# Altium schematic sheet STM32WL_ADC.SchDoc
size A4; SheetNumber: 5; SheetTotal: 5; SPICEModelCacheMWGQCNEB: <root> / <DocumentId>MWGQCNEB</DocumentId> / <CacheFrame Number="0"> / <Model Name="mcp6001" Kind="CKT"> / <Text>.SUBCKT MCP6001 1 2 3 4 5 / *               | | | | | / *               | | | | Output / *               | | | Negative Supply / *               | | Positive Supply / *               | Inverting Input / *               Non-inverting Input / * / ******************************************************************************** / * Software License Agreement                                                   * / *                                                                              * / * The software supplied herewith by Microchip Technology Incorporated (the     * / * "Company") is intended and supplied to you, the Company's customer, for use  * / * soley and exclusively on Microchip products.                                 * / *                                                                              * / * The software is owned by the Company and/or its supplier, and is protected   * / * under applicable copyright laws. All rights are reserved. Any use in         * / * violation of the foregoing restrictions may subject the user to criminal     * / * sanctions under applicable laws, as well as to civil liability for the       * / * breach of the terms and conditions of this license.                          * / *                                                                              * / * THIS SOFTWARE IS PROVIDED IN AN "AS IS" CONDITION. NO WARRANTIES, WHETHER    * / * EXPRESS, IMPLIED OR STATUTORY, INCLUDING, BUT NOT LIMITED TO, IMPLIED        * / * WARRANTIES OF MERCHANTABILITY AND FITNESS FOR A PARTICULAR PURPOSE APPLY TO  * / * THIS SOFTWARE. THE COMPANY SHALL NOT, IN ANY CIRCUMSTANCES, BE LIABLE FOR    * / * SPECIAL, INCIDENTAL OR CONSEQUENTIAL DAMAGES, FOR ANY REASON WHATSOEVER.     * / ******************************************************************************** / * / * Macromodel for the MCP6001/2/4 op amp family: / *   MCP6001, MCP6001R, MCP6001U, MCP6002, MCP6004 / * / * Revision History: / *   REV A: 21-Jun-02, Created model / *   REV B: 16-Jul-02, Improved output stage / *   REV C: 03-Jan-03, Added MCP6001 / *   REV D: 19-Aug-06, Added over temperature, improved output stage, / *                     fixed overdrive recovery time / *   REV E: 27-Jul-07, Updated output impedance for better model stability w/cap load / *   REV F: 09-Jul-12, Added MCP6001R, MCP6001U / * / * Recommendations: / *   Use PSPICE (other simulators may require translation) / *   For a quick, effective design, use a combination of: data sheet / *     specs, bench testing, and simulations with this macromodel / *   For high impedance circuits, set GMIN=100F in .OPTIONS / * / * Supported: / *   Typical performance for temperature range (-40 to 125) degrees Celsius / *   DC, AC, Transient, and Noise analyses. / *   Most specs, including: offsets, DC PSRR, DC CMRR, input impedance, / *     open loop gain, voltage ranges, supply current, ... , etc. / *   Temperature effects for Ibias, Iquiescent, Iout short circuit / *   current, Vsat on both rails, Slew Rate vs. Temp and P.S. / * / * Not Supported: / *   Some Variation in specs vs. Power Supply Voltage / *   Monte Carlo (Vos, Ib), Process variation / *   Distortion (detailed non-linear behavior) / *   Behavior outside normal operating region / * / * Input Stage / V10  3 10 -500M / R10 10 11 6.90K / R11 10 12 6.90K / C11 11 12 0.2p / C12 1  0 6.00P / E12 71 14 POLY(4) 20 0 21 0 26 0 27 0   1.00M 20.1 20.1 1 1 / G12 1 0 62 0 1m / M12 11 14 15 15 NMI L=2.00U W=42.0U / M14 12  2 15 15 NMI L=2.00U W=42.0U / G14 2 0 62 0 1m / C14  2  0 6.00P / I15 15  4 50.0U / V16 16  4 -300M / GD16 16 1 TABLE {V(16,1)} ((-100,-1p)(0,0)(1m,1n)(2m,1m)(3m,1)) / V13  3 13 -300M / GD13 2 13 TABLE {V(2,13)} ((-100,-1p)(0,0)(1m,1n)(2m,1m)(3m,1)) / R70 1 0 20.6T / R71 2 0 20.6T / R72 1 2 20T / I80 1 2 0.5p / * / * Noise, PSRR, and CMRR / I20 21 20 423U / D20 20  0 DN1 / D21  0 21 DN1 / G26  0 26 POLY(1) 3 4   110U -49U / R26 26  0 1 / G27  0 27 POLY(2) 1 0 2 0   -440U 39.7U 39.7U / R27 27  0 1 / * / * Open Loop Gain, Slew Rate / G30  0 30 POLY(1) 12 11   0 1 / R30 30  0 1K / G31  0 31 POLY(1) 3 4 86 5.25 / R31 31  0 1 TC=2.8m / GD31 30 31 TABLE {V(30,31)} ((-11,-1)(-10,-10n)(0,0)(1m,1000)) / G32 32  0 POLY(1) 3 4 113.7 3.5 / R32 32  0 1 TC=2.65m / GD32 30 32 TABLE {V(30,32)} ((-1m,-1000)(0,0)(10,10n)(11,1)) / G33 0 33 30 0 1m / R33 33 0 1k / G34  0 34 33 0 425M / R34  34 0 1K / C34  34 0 74U / G37  0 37 34 0 1m / R37  37 0 1K / C37  37 0 41.6P / G38  0 38 37 0 1m / R38  39 0 1K / L38  38 39 100U / E38  35 0 38 0 1 / G35 33 0 TABLE {V(35,3)} ((-1,-1n)(0,0)(16,1n))(16.1,1)) / G36 33 0 TABLE {V(35,4)} ((-16.1,-1)((-16,-1n)(0,0)(1,1n)) / * / * Output Stage / R80 50 0 100MEG / G50 0 50 57 96 2 / R58 57  96 0.50 / R57 57  0 750 / C58  5  0 2.00P / G57  0 57 POLY(3) 3 0 4 0 35 0   0 0.67M 0.67M 1.5M / GD55 55 57 TABLE {V(55,57)} ((-2m,-1)(-1m,-1m)(0,0)(10,1n)) / GD56 57 56 TABLE {V(57,56)} ((-2m,-1)(-1m,-1m)(0,0)(10,1n)) / E55 55  0 POLY(2) 3 0 51 0 -0.7m 1 -40.0M / E56 56  0 POLY(2) 4 0 52 0 1.2m 1 -37.0M / R51 51 0 1k / R52 52 0 1k / GD51 50 51 TABLE {V(50,51)} ((-10,-1n)(0,0)(1m,1m)(2m,1)) / GD52 50 52 TABLE {V(50,52)} ((-2m,-1)(-1m,-1m)(0,0)(10,1n)) / G53  3  0 POLY(1) 51 0  -49U 1M / G54  0  4 POLY(1) 52 0  -49U -1M / * / * Current Limit / G99 96 5 99 0 1 / R98 0 98 1 TC=-2.8M,2.63U / G97 0 98 TABLE { V(96,5) } ((-11.0,-10.0M)(-1.00M,-9.9M)(0,0)(1.00M,9.9M)(11.0,10.0M)) / E97 99 0 VALUE { V(98)*((V(3)-V(4))*359M + 310M)} / D98 4 5 DESD / D99 5 3 DESD / * / * Temperature / Voltage Sensitive IQuiscent / R61 0 61 100 TC 3.11M 4.51U / G61 3 4 61 0 1 / G60 0 61 TABLE {V(3, 4)} / + ((0,0)(900M,0.0106U)(1.00,0.20U)(1.3,0.63U) / + (1.5,0.66U)(1.6,1.06U)(5.5,1.10U)) / * / * Temp Sensitive offset voltage / I73 0 70 DC 1uA / R74 0 70 1 TC=2 / E75 1 71 70 0 1 / * / * Temp Sensistive IBias / I62 0 62 DC 1uA / R62 0 62 REXP 58.2u / * Voltage on R62 used for G12, G14 in input stage / * / * Models / .MODEL NMI NMOS / .MODEL DESD  D   N=1 IS=1.00E-15 / .MODEL DL  D   N=1 IS=1F / .MODEL DN1 D   IS=1P KF=146E-18 AF=1 / .MODEL REXP RES TCE=10.1 / .ENDS MCP6001</Text> / </Model> / </CacheFrame> / </root>
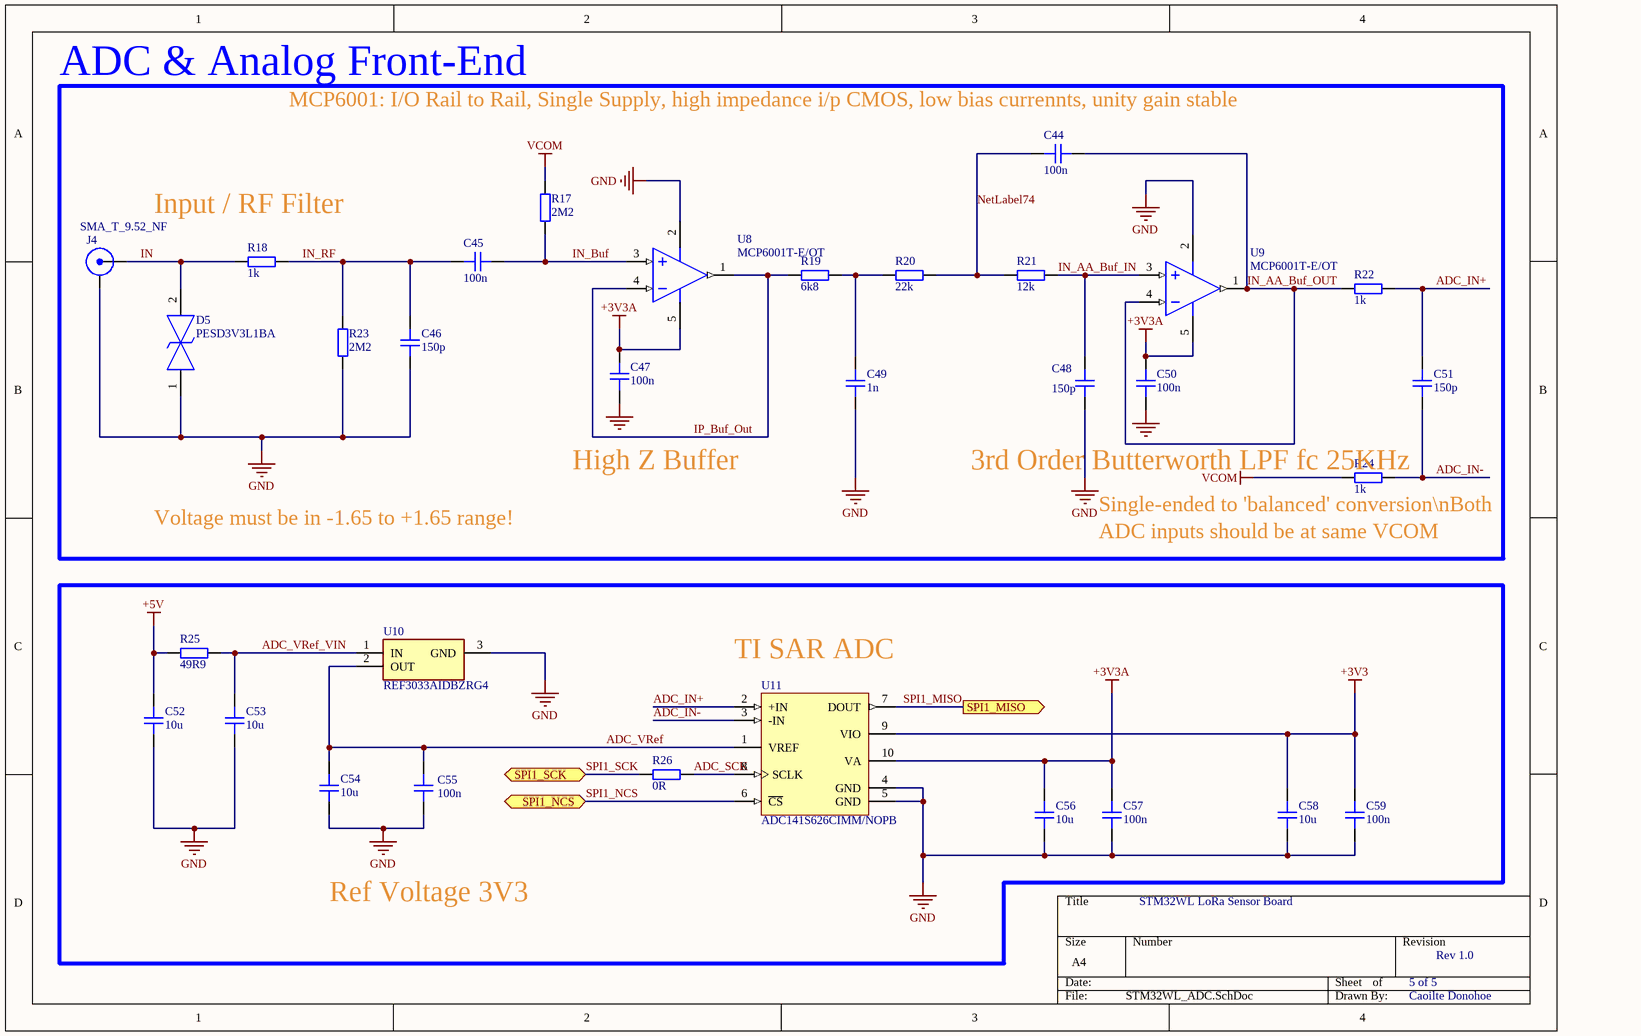
[diagram p0: STM32WL_ADC.SchDoc]

## Parts
C44  100n  [CAP_0402]
C45  100n  [CAP_0402]
C46  150p  [CAP_0402]
C47  100n  [CAP_0402]
C48  150p  [CAP_0402]
C49  1n  [CAP_0402]
C50  100n  [CAP_0402]
C51  150p  [CAP_0402]
C52  10u  [CAP_0603]
C53  10u  [CAP_0603]
C54  10u  [CAP_0603]
C55  100n  [CAP_0402]
C56  10u  [CAP_0603]
C57  100n  [CAP_0402]
C58  10u  [CAP_0603]
C59  100n  [CAP_0402]
D5  PESD3V3L1BA  [SOD2512X110N]
J4  SMA_T_9.52_NF  [CO_SAMTEC_SMA-J-P-ST-EMI]
R17  2M2  [RES_0402]
R18  1k  [RES_0402]
R19  6k8  [RES_0402]
R20  22k  [RES_0402]
R21  12k  [RES_0402]
R22  1k  [RES_0402]
R23  2M2  [RES_0402]
R24  1k  [RES_0402]
R25  49R9  [RES_0402]
R26  0R  [RES_0402]
U8  MCP6001T-E/OT  [SOT-23-OT5_L]
U9  MCP6001T-E/OT  [SOT-23-OT5_L]
U10  REF3033AIDBZRG4  [SOT95P237X112-3N]
U11  ADC141S626CIMM/NOPB  [MUB10A_M]

## Blocks framed on the sheet
ADC & Analog Front-End: C44-C51 D5 J4 R17-R24 U8 U9

## Ports
SPI1_MISO (out, see STM32WL_MCU_IOs[2B]), SPI1_NCS (bidir, see STM32WL_MCU_IOs[2B]), SPI1_SCK (bidir, see STM32WL_MCU_IOs[1B])

## Nets
+3V3: C58.2 C59.2 U11.9(VIO)
+3V3A: C47.1 C50.1 C56.2 C57.2 U8.5(VDD) U9.5(VDD) U11.10(VA)
+5V: C52.2 R25.1
GND: C46.1 C47.2 C48.1 C49.1 C50.2 C52.1 C53.1 C54.1 C55.1 C56.1 C57.1 C58.1 C59.1 D5.1 J4.2(Y) R23.1 U8.2(VSS) U9.2(VSS) U10.3(GND) U11.4(GND) U11.5(GND)
VCOM: R17.2 R24.2
ADC_IN+: C51.1 R22.1 U11.2(+IN)
ADC_IN-: C51.2 R24.1 U11.3(-IN)
ADC_SCK: R26.2 U11.8(SCLK)
ADC_VRef: C54.2 C55.2 U10.2(OUT) U11.1(VREF)
ADC_VRef_VIN: C53.2 R25.2 U10.1(IN)
IN: D5.2 J4.1(X) R18.1
IN_AA_Buf_IN: C48.2 R21.1 U9.3(VIN+)
IN_AA_Buf_OUT: C44.1 R22.2 U9.1(VOUT) U9.4(VIN-)
IN_Buf: C45.1 R17.1 U8.3(VIN+)
IN_RF: C45.2 C46.2 R18.2 R23.2
IP_Buf_Out: R19.2 U8.1(VOUT) U8.4(VIN-)
NetLabel74: C44.2 R20.1 R21.2
SPI1_MISO: U11.7(DOUT) ; port SPI1_MISO
SPI1_NCS: U11.6(~{CS}) ; port SPI1_NCS
SPI1_SCK: R26.1 ; port SPI1_SCK
NetC49_2: C49.2 R19.1 R20.2

## Notes on the sheet
- (near C44) MCP6001: I/O Rail to Rail, Single Supply, high impedance i/p CMOS, low bias currennts, unity gain stable
- (near R18) Input / RF Filter
- High Z Buffer
- (near R24) 3rd Order Butterworth LPF fc 25KHz
- (near R24) Single-ended to 'balanced' conversion\nBoth
- Voltage must be in -1.65 to +1.65 range!
- (near R24) ADC inputs should be at same VCOM
- (near U11) TI SAR ADC
- Ref Voltage 3V3
- STM32WL LoRa Sensor Board
- 5 of 5
- Rev 1.0
- Caoilte Donohoe

## Library data of the parts
C44-C51 C55 C57 C59 = CAP_0402_16V: Capacitor SMD 0402 16V
C52-C54 C56 C58 = CAP_0603_16V: Capacitor SMD 0603 16V
D5 = PESD3V3L1BA: TVS Diode (Bi-directional); Manufacturer_Name: Nexperia; Datasheet Link: https://datasheet.datasheetarchive.com/originals/distributors/Datasheets-26/DSA-502681.pdf; Height: 1.1mm; Manufacturer_Part_Number: PESD3V3L1BA; Mouser Part Number: N/A; Mouser Price/Stock: https://www.mouser.co.uk/ProductDetail/Nexperia/PESD3V3L1BA?qs=vHuUswq2%252BswBNSPO0jzUyg%3D%3D
J4 = SMA_T_9.52_NF: SMA End Launch Jack 1.0 mm Board, 50 ohm; Manufacturer: COAX CONNECTORS LTD; Manufacturer_Part_Number: 30-462-D3-1.1mm
R17-R26 = RES_0402: Resistor SMD 0402
U8 U9 = CMP-0187-00458-3: None; Output Current: 23mA; Number of Circuits: 1; Input Offset Voltage-Max: 4.5mV; Nominal Supply Current: 100uA; Min Supply Voltage: 1.8V; Voltage: 6V; Operating Supply Voltage: 5.5V; Gain Bandwidth Product: 1MHz; Amplifier Type: GENERAL PURPOSE; Voltage Gain: 112dB; Slew Rate: 0.6V/µs; Power Supply Rejection Ratio (PSRR): 86dB; Input Bias Current: 1pA; Common Mode Rejection Ratio: 60dB; Package Quantity: 3000; Lead Free: Lead Free; Case/Package: SOT-23; Max Operating Temperature: 125°C; RoHS Compliant: Yes; Radiation Hardening: No; Number of Channels: 1; Length: 3.1mm; Height: 1.3mm; Output Current per Channel: 23mA; Supply Current: 100uA; Packaging: Tape and Reel; Technology: CMOS; Number of Elements: 1; Number of Pins: 5; Input Offset Voltage (Vos): 4.5mV; Width: 1.8mm; Contact Plating: Tin; Mount: Surface Mount; Slew Rate-Nom: 0.6V/µs; Unity Gain Bandwidth Product: 1MHz; REACH SVHC: No SVHC; Number of Amplifiers: 1; Max Supply Voltage: 6V; Operating Supply Current: 100uA; Min Operating Temperature: -40°C; Bandwidth: 1MHz
U10 = REF3033AIDBZRG4: Integrated Circuit; Manufacturer_Name: Texas Instruments; Datasheet Link: https://www.ti.com/lit/ds/symlink/ref3030.pdf?ts=1639296719724; Height: 1.12mm; Manufacturer_Part_Number: REF3033AIDBZRG4; Mouser Part Number: 595-REF3033AIDBZRG4; Mouser Price/Stock: https://www.mouser.co.uk/ProductDetail/Texas-Instruments/REF3033AIDBZRG4?qs=sSOk4GDDv7x3KhdEagQjiQ%3D%3D; Arrow Part Number: REF3033AIDBZRG4; Arrow Price/Stock: https://www.arrow.com/en/products/ref3033aidbzrg4/texas-instruments
U11 = CMP-0054-00477-2: 14-Bit, 50 kSPS to 250 kSPS, Differential Input, Micro Power A/D Converter, 10-pin Mini SOIC, Pb-Free; Manufacturer: National Semiconductor; CompType: ADC IC; PowerWise: Y; PackageTopMarking: ZXTT*X94C; DatasheetVersion: Jan-2009; PackageVersion: revB, Jul-2003; RoHS: Y; ComponentLink3Description: MUB10A Package Page; ComponentLink2URL: http://www.national.com/pf/AD/ADC141S626.html; Code_JEDEC: MO-187-BA; PackageReference: MUB10A; ComponentLink3URL: http://www.national.com/packaging/folders/mub10a.html; ComponentLink1URL: http://www.national.com/ds/AD/ADC141S626.pdf; PinCount: 10; RevisionNote: Component URLs added; PackageDescription: Mini-SO, Molded, .118 x .118 x .034in Body, 10 Lead, .0197in Pitch; ComponentLink1Description: ADC141S626 Datasheet; ComponentLink2Description: ADC141S626 Web Page